# EAGLE schematic LightStickPower (EAGLE 7.6.0)
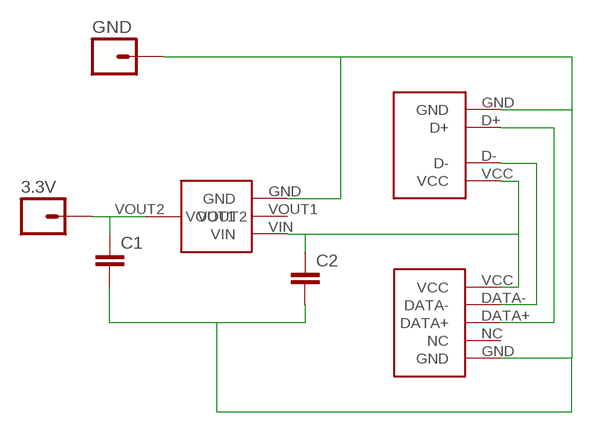
[diagram p0: schematic, sheet 1]

## Parts
3.3V  M01PTH  [1X01]
C1  CAP0805  [0805]
C2  CAP0805  [0805]
GND  M01PTH  [1X01]
USB1  USB_A_932  [USB_A_932]
USB2  USB_MICROB_PLUG_ZX64_B_5S  [USB_MICROB_PLUG_ZX64_B_5S]
V1  VOLTAGE_REGULATOR_AP2114H  [SOT-223]

## Nets
N$1: C2.1 USB1.VCC USB2.VCC V1.VIN
N$2: USB1.D- USB2.DATA-
N$3: USB1.D+ USB2.DATA+
N$5: C1.2 C2.2 GND.1 USB1.GND USB2.GND V1.GND
N$7: 3.3V.1 C1.1 V1.VOUT2
Unconnected: USB2.NC V1.VOUT1

## Library data of the parts
3.3V GND = SparkFun-Connectors:M01: Header 1 Standard 1-pin 0.1" header. Use with straight break away headers (SKU : PRT-00116), right angle break away headers (PRT-00553), swiss pins (PRT-00743), machine pins (PRT-00117), and female headers (PRT-00115).
C1 C2 = SparkFun-Capacitors:CAP: Capacitor Standard 0603 ceramic capacitor, and 0.1" leaded capacitor.
USB1 = freddyLibr:USB_A_932: USB A Plug. Through hole.
USB2 = freddyLibr:USB_MICROB_PLUG_ZX64_B_5S
V1 = freddyLibr:VOLTAGE_REGULATOR_AP2114H